# Altium project cB_cC_cE.PrjPcb
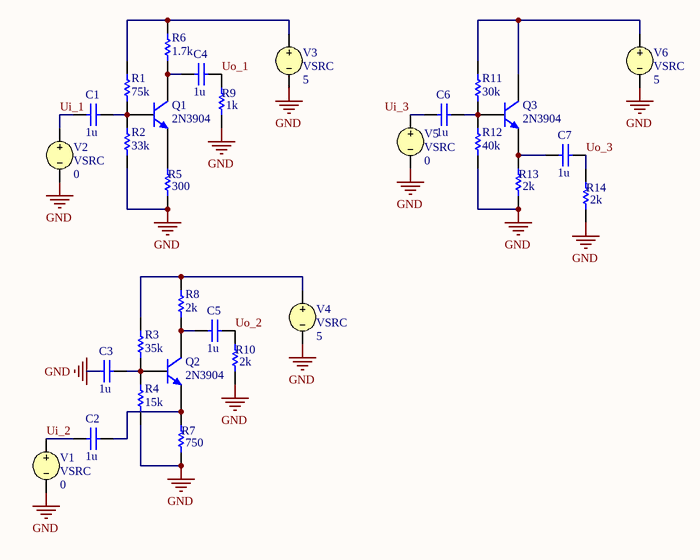
[diagram p0: Sheet1.SchDoc]
1 sheet, 30 parts. Net scope: global (net labels, ports and power ports of the same name join across sheets).

## Sheet Sheet1.SchDoc
size A4; SheetNumber: 1; SheetTotal: 2

### Parts
C1  value 1u  (hidden comment: Capacitor)
C2  value 1u  (hidden comment: Capacitor)
C3  value 1u  (hidden comment: Capacitor)
C4  value 1u  (hidden comment: Capacitor)
C5  value 1u  (hidden comment: Capacitor)
C6  value 1u  (hidden comment: Capacitor)
C7  value 1u  (hidden comment: Capacitor)
Q1  2N3904  [TO-92A]
Q2  2N3904  [TO-92A]
Q3  2N3904  [TO-92A]
R1  value 75k  (hidden comment: Resistor)
R2  value 33k  (hidden comment: Resistor)
R3  value 35k  (hidden comment: Resistor)
R4  value 15k  (hidden comment: Resistor)
R5  value 300  (hidden comment: Resistor)
R6  value 1.7k  (hidden comment: Resistor)
R7  value 750  (hidden comment: Resistor)
R8  value 2k  (hidden comment: Resistor)
R9  value 1k  (hidden comment: Resistor)
R10  value 2k  (hidden comment: Resistor)
R11  value 30k  (hidden comment: Resistor)
R12  value 40k  (hidden comment: Resistor)
R13  value 2k  (hidden comment: Resistor)
R14  value 2k  (hidden comment: Resistor)
V1  VSRC  DC Magnitude: 0
V2  VSRC  DC Magnitude: 0
V3  VSRC  value 5
V4  VSRC  value 5
V5  VSRC  DC Magnitude: 0
V6  VSRC  value 5

### Nets
GND: C3.1 R2.1 R4.1 R5.1 R7.1 R9.1 R10.1 R12.1 R13.1 R14.1 V1.2 V2.2 V3.2 V4.2 V5.2 V6.2
Ui_1: C1.1 V2.1
Ui_2: C2.1 V1.1
Ui_3: C6.1 V5.1
Uo_1: C4.2 R9.2
Uo_2: C5.2 R10.2
Uo_3: C7.2 R14.2
NetC1_2: C1.2 Q1.2(B) R1.1 R2.2
NetC2_2: C2.2 Q2.1(E) R7.2
NetC3_2: C3.2 Q2.2(B) R3.1 R4.2
NetC4_1: C4.1 Q1.3(C) R6.1
NetC5_1: C5.1 Q2.3(C) R8.1
NetC6_2: C6.2 Q3.2(B) R11.1 R12.2
NetC7_1: C7.1 Q3.1(E) R13.2
NetQ1_1: Q1.1(E) R5.2
NetQ3_3: Q3.3(C) R11.2 V6.1
NetR1_2: R1.2 R6.2 V3.1
NetR3_2: R3.2 R8.2 V4.1

### Library data of the parts
C1-C7 = Capacitor: SimulationGenericComponent: True
Q1-Q3 = 2N3904: NPN General Purpose Amplifier; Published: 8-Jun-2000; LatestRevisionDate: 15-Jan-2003; LatestRevisionNote: PCB Footprint 'BCY-W3/D4.7' replaced; DatasheetVersion: 1997; PackageVersion: Sep-1998; PackageReference: TO-92A; Publisher: Altium Limited; PackageDescription: TO, Flat Index; 3 In-Line, Axial Leads; Body Dia. 4.5mm; Leads 0.51 x 0.48 mm (max); ComponentLink1Description: Manufacturer Link; ComponentLink1URL: http://www.fairchildsemi.com/; ComponentLink2Description: Datasheet; ComponentLink2URL: http://www.fairchildsemi.com/ds/2N%2F2N3904.pdf
R1-R14 = Resistor: TC1: 0; SimulationGenericComponent: True; TC2: 0
V1 V2 V5 = VSRC: Voltage Source; Note: PCB Footprint - Not required; AC Magnitude: 1; Amplitude: 0.5; Frequency: 100; Published: 30-July-2020; LatestRevisionDate: 30-July-2020; LatestRevisionNote: Re-released for DXP Platform.; PackageReference: Not Applicable; Publisher: Altium Limited; AC Phase: 0; Offset: 0; Delay: 0; Damping Factor: 0; Phase: 0
V3 V4 V6 = VSRC: Voltage Source; Note: PCB Footprint - Not required; AC Magnitude: 0; Published: 30-July-2020; LatestRevisionDate: 30-July-2020; LatestRevisionNote: Re-released for DXP Platform.; PackageReference: Not Applicable; Publisher: Altium Limited; AC Phase: 0